# Altium project ATmega_2560_Pro.PrjPcb (part 3 of 4)
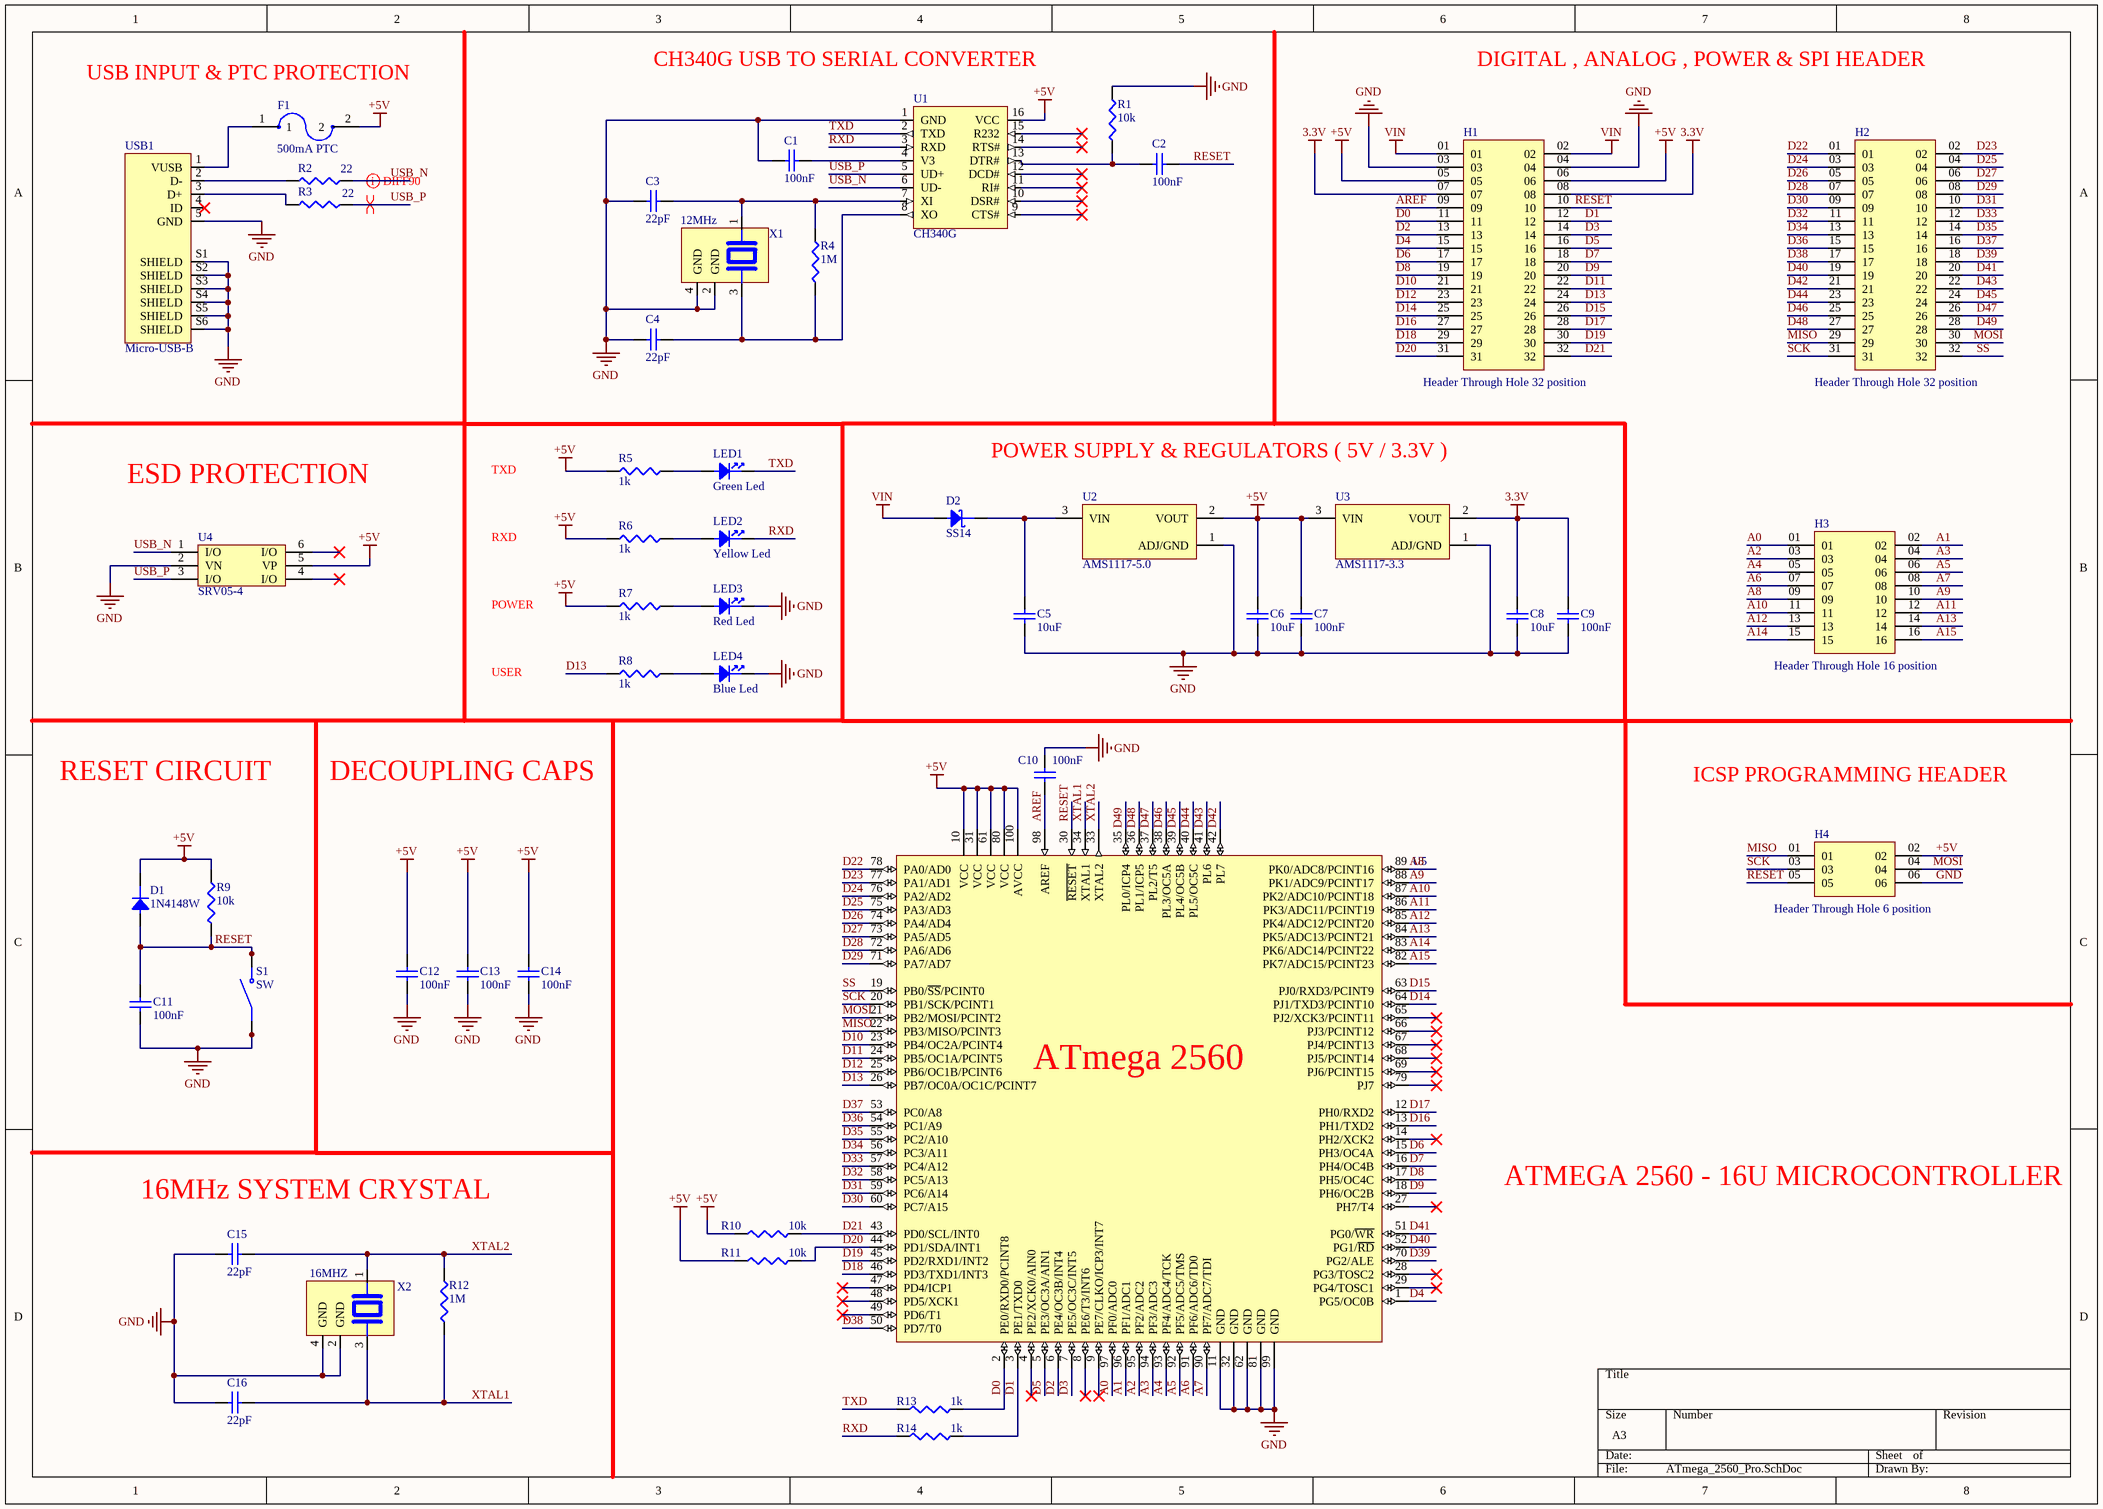
[diagram p2: ATmega_2560_Pro.SchDoc]

## Sheet ATmega_2560_Pro.SchDoc (continued)

### Library data of the parts (continued)
LED1 = 150060VS75000: LED GREEN CLEAR 0603 SMD; Manufacturer: Wurth Elektronik; Manufacturer Lifecycle Status: ACTIVE; Dominant Wavelength: 570nm; Forward Current: 100mA; Forward Voltage: 2V; Lens Style: Clear, Rectangular; Luminous Intensity: 40mcd; Max Junction Temperature (Tj): 95°C; Max Reverse Voltage (DC): 5V; Peak Wavelength: 572nm; Power Dissipation: 72mW; Test Current: 20mA; Viewing Angle: 140°; YEOL: 1 = Estimated lifetime > 10 years; Supplier: DigiKey; Supplier Part Number: 732-4980-1-ND; Manufacturer Part Number: 150060VS75000; RoHS: Compliant; Category: LEDs; Stock: 627050; Pricing: 1=0.15, 50=0.142, 100=0.1239 (USD); Case/Package: 0603; Case Code (Imperial): 0603; Case Code (Metric): 1608; Color: Green; Height: 700µm; Length: 1.6mm; Lifecycle Status: Production; Max Operating Temperature: 85°C; Min Operating Temperature: -40°C; Mounting Technology: Surface Mount; Pins: 2; Packaging: Tape and Reel; REACH SVHC: Unknown; Reverse Voltage: 5V; Wavelength: 570nm; Width: 800µm; ComponentLink1URL: https://datasheet.octopart.com:443/150060VS75000-W%C3%BCrth-Elektronik-datasheet-141404641.pdf?src-supplier=Upverter; ComponentLink1Description: https://datasheet.octopart.com:443/150060VS75000-W%C3%BCrth-Elektronik-datasheet-141404641.pdf?src-supplier=Upverter; ComponentLink2URL: https://datasheet.octopart.com:443/150060VS75000-W%C3%BCrth-Elektronik-datasheet-15983789.pdf?src-supplier=Upverter; ComponentLink2Description: https://datasheet.octopart.com:443/150060VS75000-W%C3%BCrth-Elektronik-datasheet-15983789.pdf?src-supplier=Upverter; ComponentLink3URL: https://datasheet.octopart.com:443/150060VS75000-W%C3%BCrth-Elektronik-datasheet-141916710.pdf?src-supplier=Newark; ComponentLink3Description: https://datasheet.octopart.com:443/150060VS75000-W%C3%BCrth-Elektronik-datasheet-141916710.pdf?src-supplier=Newark; ComponentLink4URL: https://datasheet.octopart.com:443/150060VS75000-W%C3%BCrth-Elektronik-datasheet-41196440.pdf?src-supplier=Newark; ComponentLink4Description: https://datasheet.octopart.com:443/150060VS75000-W%C3%BCrth-Elektronik-datasheet-41196440.pdf?src-supplier=Newark
LED2 = 150060YS75000: LED YELLOW CLEAR 0603 SMD; Manufacturer: Wurth Elektronik; Manufacturer Lifecycle Status: ACTIVE; Dominant Wavelength: 590nm; Forward Current: 100mA; Forward Voltage: 2V; Lens Style: Clear, Rectangular; Luminous Intensity: 120mcd; Max Junction Temperature (Tj): 95°C; Max Reverse Voltage (DC): 5V; Peak Wavelength: 595nm; Power Dissipation: 72mW; Test Current: 20mA; Viewing Angle: 140°; YEOL: 1 = Estimated lifetime > 10 years; Supplier: DigiKey; Supplier Part Number: 732-4981-1-ND; Manufacturer Part Number: 150060YS75000; RoHS: Compliant; Category: LEDs; Stock: 129880; Pricing: 1=0.15, 50=0.142, 100=0.1239 (USD); Case/Package: 0603; Case Code (Imperial): 0603; Case Code (Metric): 1608; Color: Yellow; Height: 700µm; Length: 1.6mm; Lifecycle Status: Production; Max Operating Temperature: 85°C; Min Operating Temperature: -40°C; Mounting Technology: Surface Mount; Packaging: Tape and Reel; REACH SVHC: Unknown; Reverse Voltage: 5V; Wavelength: 590nm; Width: 800µm; ComponentLink1URL: https://datasheet.octopart.com:443/150060YS75000-W%C3%BCrth-Elektronik-datasheet-140603452.pdf?src-supplier=Newark; ComponentLink1Description: https://datasheet.octopart.com:443/150060YS75000-W%C3%BCrth-Elektronik-datasheet-140603452.pdf?src-supplier=Newark; ComponentLink2URL: https://datasheet.octopart.com:443/150060YS75000-W%C3%BCrth-Elektronik-datasheet-41196441.pdf?src-supplier=Newark; ComponentLink2Description: https://datasheet.octopart.com:443/150060YS75000-W%C3%BCrth-Elektronik-datasheet-41196441.pdf?src-supplier=Newark; ComponentLink3URL: https://datasheet.octopart.com:443/150060YS75000-W%C3%BCrth-Elektronik-datasheet-15976795.pdf?src-supplier=Upverter; ComponentLink3Description: https://datasheet.octopart.com:443/150060YS75000-W%C3%BCrth-Elektronik-datasheet-15976795.pdf?src-supplier=Upverter
LED3 = 150060RS75000: LED RED CLEAR 0603 SMD; Manufacturer: Wurth Elektronik; Manufacturer Lifecycle Status: ACTIVE; Dominant Wavelength: 625nm; Forward Current: 100mA; Forward Voltage: 2V; Lens Style: Clear, Rectangular; Luminous Intensity: 250mcd; Max Junction Temperature (Tj): 95°C; Max Reverse Voltage (DC): 5V; Peak Wavelength: 630nm; Power Dissipation: 72mW; Test Current: 20mA; Viewing Angle: 140°; YEOL: 1 = Estimated lifetime > 10 years; Supplier: DigiKey; Supplier Part Number: 732-4978-6-ND; Manufacturer Part Number: 150060RS75000; RoHS: Compliant; Category: LEDs; Stock: 386931; Pricing: 1=0.15, 50=0.142, 100=0.1239 (USD); Case/Package: 0603; Case Code (Imperial): 0603; Case Code (Metric): 1608; Color: Red; Height: 700µm; Length: 1.6mm; Lifecycle Status: Production; Max Operating Temperature: 85°C; Min Operating Temperature: -40°C; Mounting Technology: Surface Mount; Packaging: Tape and Reel; REACH SVHC: Unknown; Reverse Voltage: 5V; Wavelength: 625nm; Width: 800µm; ComponentLink1URL: https://datasheet.octopart.com:443/150060RS75000-W%C3%BCrth-Elektronik-datasheet-141913886.pdf?src-supplier=Upverter; ComponentLink1Description: https://datasheet.octopart.com:443/150060RS75000-W%C3%BCrth-Elektronik-datasheet-141913886.pdf?src-supplier=Upverter; ComponentLink2URL: https://datasheet.octopart.com:443/150060RS75000-W%C3%BCrth-Elektronik-datasheet-15983787.pdf?src-supplier=Upverter; ComponentLink2Description: https://datasheet.octopart.com:443/150060RS75000-W%C3%BCrth-Elektronik-datasheet-15983787.pdf?src-supplier=Upverter; ComponentLink3URL: https://datasheet.octopart.com:443/150060RS75000-W%C3%BCrth-Elektronik-datasheet-140603451.pdf?src-supplier=Wurth+Elektronik; ComponentLink3Description: https://datasheet.octopart.com:443/150060RS75000-W%C3%BCrth-Elektronik-datasheet-140603451.pdf?src-supplier=Wurth+Elektronik; ComponentLink4URL: https://datasheet.octopart.com:443/150060RS75000-W%C3%BCrth-Elektronik-datasheet-41196438.pdf?src-supplier=Newark; ComponentLink4Description: https://datasheet.octopart.com:443/150060RS75000-W%C3%BCrth-Elektronik-datasheet-41196438.pdf?src-supplier=Newark
LED4 = 150060BS75000: LED BLUE CLEAR 0603 SMD; Manufacturer: Wurth Elektronik; Manufacturer Lifecycle Status: ACTIVE; Dominant Wavelength: 470nm; Forward Current: 100mA; Forward Voltage: 3.2V; Lens Style: Clear, Rectangular; Luminous Intensity: 145mcd; Max Junction Temperature (Tj): 95°C; Max Reverse Voltage (DC): 5V; Peak Wavelength: 465nm; Power Dissipation: 105mW; Test Current: 20mA; Viewing Angle: 140°; YEOL: 1 = Estimated lifetime > 10 years; Supplier: DigiKey; Supplier Part Number: 732-4966-6-ND; Manufacturer Part Number: 150060BS75000; RoHS: Compliant; Category: LEDs; Stock: 157758; Pricing: 1=0.16, 50=0.155, 100=0.1346 (USD); Case/Package: 0603; Case Code (Imperial): 0603; Case Code (Metric): 1608; Color: Blue; Height: 700µm; Length: 1.6mm; Lifecycle Status: Production; Max Operating Temperature: 85°C; Min Operating Temperature: -40°C; Mounting Technology: Surface Mount; Packaging: Tape and Reel; REACH SVHC: Unknown; Reverse Voltage: 5V; Wavelength: 470nm; Width: 800µm; ComponentLink1URL: https://datasheet.octopart.com:443/150060BS75000-W%C3%BCrth-Elektronik-datasheet-140583947.pdf?src-supplier=Newark; ComponentLink1Description: https://datasheet.octopart.com:443/150060BS75000-W%C3%BCrth-Elektronik-datasheet-140583947.pdf?src-supplier=Newark; ComponentLink2URL: https://datasheet.octopart.com:443/150060BS75000-W%C3%BCrth-Elektronik-datasheet-41196436.pdf?src-supplier=Newark; ComponentLink2Description: https://datasheet.octopart.com:443/150060BS75000-W%C3%BCrth-Elektronik-datasheet-41196436.pdf?src-supplier=Newark; ComponentLink3URL: https://datasheet.octopart.com:443/150060BS75000-W%C3%BCrth-Elektronik-datasheet-15983786.pdf?src-supplier=Upverter; ComponentLink3Description: https://datasheet.octopart.com:443/150060BS75000-W%C3%BCrth-Elektronik-datasheet-15983786.pdf?src-supplier=Upverter
R1 R9-R11 = RC0603FR-0710KL: RES 10K OHM 1% 1/10W 0603; Manufacturer 1: Yageo Group; Power Rating: 100mW; Value: 10kΩ; Temperature Coefficient: 100ppm/°C; Voltage Rating: 75V; Voltage Rating (DC): 50V; Supplier 1: DigiKey; Manufacturer Part Number 1: RC0603FR-0710KL; Stock 1: 2515430; Pricing 1: 1=0.1, 10=0.025, 25=0.0188, 50=0.015, 100=0.0122, 250=0.0094, 500=0.00782, 1000=0.00661 (USD); RoHS: Compliant; Case/Package: 0603; Case Code (Imperial): 0603; Case Code (Metric): 0603; China RoHS: Non-Compliant; Composition: Thick Film; Contact Plating: Tin; Depth: 800µm; Height: 450µm; Lead Free: Lead Free; Lead Pitch: 300µm; Length: 1.6mm; Lifecycle Status: Production; Max Operating Temperature: 155°C; Military Standard: Not; Min Operating Temperature: -55°C; Mounting Technology: Surface Mount; Pins: 2; Number of Terminals: 2; Packaging: Tape & Reel; Radiation Hardening: No; REACH SVHC: Unaffected; Schedule B: 8533210045, 8533210045|8533210045|8533210045|8533210045|8533210045|8533210045|8533210045|8533210045|8533210045|8533210045|8533210045|8533210045|8533210045|8533210045|8533210045|8533210045|8533210045|8533210045|8533210045|8533210045|8533210045|8533210045|8533210045|85; Termination: SMD/SMT; Tolerance: 1%; Weight: 2.012816mg; Width: 800µm; Working Voltage: 75V; ComponentLink1URL: https://datasheet.octopart.com:443/RC0603FR-0710KL-Yageo-datasheet-175887523.pdf?src-supplier=IHS; ComponentLink1Description: https://datasheet.octopart.com:443/RC0603FR-0710KL-Yageo-datasheet-175887523.pdf?src-supplier=IHS; ComponentLink2URL: https://datasheet.octopart.com:443/RC0603FR-0710KL-Yageo-datasheet-103092701.pdf?src-supplier=Upverter; ComponentLink2Description: https://datasheet.octopart.com:443/RC0603FR-0710KL-Yageo-datasheet-103092701.pdf?src-supplier=Upverter; ComponentLink3URL: https://datasheet.octopart.com:443/RC0603FR-0710KL-Yageo-datasheet-98239111.pdf?src-supplier=Upverter; ComponentLink3Description: https://datasheet.octopart.com:443/RC0603FR-0710KL-Yageo-datasheet-98239111.pdf?src-supplier=Upverter; ComponentLink4URL: https://datasheet.octopart.com:443/RC0603FR-0710KL-Yageo-datasheet-141265859.pdf?src-supplier=Upverter; ComponentLink4Description: https://datasheet.octopart.com:443/RC0603FR-0710KL-Yageo-datasheet-141265859.pdf?src-supplier=Upverter; ComponentLink5URL: https://sigma.octopart.com:443/138820526/technical_drawing/Yageo-RC0603FR-0710KL.pdf?src-supplier=Upverter; ComponentLink5Description: https://sigma.octopart.com:443/138820526/technical_drawing/Yageo-RC0603FR-0710KL.pdf?src-supplier=Upverter; ComponentLink6URL: https://datasheet.octopart.com:443/RC0603FR-0710KL-Yageo-datasheet-8328172.pdf?src-supplier=Farnell; ComponentLink6Description: https://datasheet.octopart.com:443/RC0603FR-0710KL-Yageo-datasheet-8328172.pdf?src-supplier=Farnell; ComponentLink7URL: https://datasheet.octopart.com:443/RC0603FR-0710KL-Yageo-datasheet-13691069.pdf?src-supplier=Farnell; ComponentLink7Description: https://datasheet.octopart.com:443/RC0603FR-0710KL-Yageo-datasheet-13691069.pdf?src-supplier=Farnell; ComponentLink8URL: https://datasheet.octopart.com:443/RC0603FR-0710KL-Yageo-datasheet-62067350.pdf?src-supplier=element14+APAC; ComponentLink8Description: https://datasheet.octopart.com:443/RC0603FR-0710KL-Yageo-datasheet-62067350.pdf?src-supplier=element14+APAC; ComponentLink9URL: https://datasheet.octopart.com:443/RC0603FR-0710KL-Yageo-datasheet-17842380.pdf?src-supplier=element14+APAC; ComponentLink9Description: https://datasheet.octopart.com:443/RC0603FR-0710KL-Yageo-datasheet-17842380.pdf?src-supplier=element14+APAC; ComponentLink10URL: https://datasheet.octopart.com:443/RC0603FR-0710KL-Yageo-datasheet-15599030.pdf?src-supplier=Future+Electronics; ComponentLink10Description: https://datasheet.octopart.com:443/RC0603FR-0710KL-Yageo-datasheet-15599030.pdf?src-supplier=Future+Electronics; ComponentLink11URL: https://datasheet.octopart.com:443/RC0603FR-0710KL-Yageo-Group-datasheet-176638170.pdf?src-supplier=Future+Electronics; ComponentLink11Description: https://datasheet.octopart.com:443/RC0603FR-0710KL-Yageo-Group-datasheet-176638170.pdf?src-supplier=Future+Electronics; ComponentLink12URL: https://datasheet.octopart.com:443/RC0603FR-0710KL-Yageo-datasheet-164759695.pdf?src-supplier=Future+Electronics; ComponentLink12Description: https://datasheet.octopart.com:443/RC0603FR-0710KL-Yageo-datasheet-164759695.pdf?src-supplier=Future+Electronics; ComponentLink13URL: https://datasheet.octopart.com:443/RC0603FR-0710KL-Yageo-datasheet-127823281.pdf?src-supplier=Future+Electronics; ComponentLink13Description: https://datasheet.octopart.com:443/RC0603FR-0710KL-Yageo-datasheet-127823281.pdf?src-supplier=Future+Electronics; ComponentLink14URL: https://datasheet.octopart.com:443/RC0603FR-0710KL-Yageo-datasheet-137700087.pdf?src-supplier=Future+Electronics; ComponentLink14Description: https://datasheet.octopart.com:443/RC0603FR-0710KL-Yageo-datasheet-137700087.pdf?src-supplier=Future+Electronics; ComponentLink15URL: https://datasheet.octopart.com:443/RC0603FR-0710KL-Yageo-datasheet-27584510.pdf?src-supplier=Future+Electronics; ComponentLink15Description: https://datasheet.octopart.com:443/RC0603FR-0710KL-Yageo-datasheet-27584510.pdf?src-supplier=Future+Electronics; ComponentLink16URL: https://datasheet.octopart.com:443/RC0603FR-0710KL-Yageo-datasheet-8324193.pdf?src-supplier=Future+Electronics; ComponentLink16Description: https://datasheet.octopart.com:443/RC0603FR-0710KL-Yageo-datasheet-8324193.pdf?src-supplier=Future+Electronics; ComponentLink17URL: https://datasheet.octopart.com:443/RC0603FR-0710KL-Yageo-datasheet-12596169.pdf?src-supplier=Newark; ComponentLink17Description: https://datasheet.octopart.com:443/RC0603FR-0710KL-Yageo-datasheet-12596169.pdf?src-supplier=Newark; ComponentLink18URL: https://datasheet.octopart.com:443/RC0603FR-0710KL-Yageo-datasheet-503470.pdf?src-supplier=Newark; ComponentLink18Description: https://datasheet.octopart.com:443/RC0603FR-0710KL-Yageo-datasheet-503470.pdf?src-supplier=Newark; ComponentLink19URL: https://datasheet.octopart.com:443/RC0603FR-0710KL-Yageo-datasheet-34211833.pdf?src-supplier=Newark; ComponentLink19Description: https://datasheet.octopart.com:443/RC0603FR-0710KL-Yageo-datasheet-34211833.pdf?src-supplier=Newark; ComponentLink20URL: https://datasheet.octopart.com:443/RC0603FR-0710KL-Yageo-Group-datasheet-189192902.pdf?src-supplier=LCSC; ComponentLink20Description: https://datasheet.octopart.com:443/RC0603FR-0710KL-Yageo-Group-datasheet-189192902.pdf?src-supplier=LCSC; ComponentLink21URL: https://datasheet.octopart.com:443/RC0603FR-0710KL-Yageo-datasheet-79472498.pdf?src-supplier=Megastar; ComponentLink21Description: https://datasheet.octopart.com:443/RC0603FR-0710KL-Yageo-datasheet-79472498.pdf?src-supplier=Megastar; ComponentLink22URL: https://datasheet.octopart.com/RC0603FR-0710KL-Yageo-datasheet-73766026.pdf; ComponentLink22Description: https://datasheet.octopart.com/RC0603FR-0710KL-Yageo-datasheet-73766026.pdf; ComponentLink23URL: https://datasheet.octopart.com:443/RC0603FR-0710KL-Yageo-datasheet-118562.pdf?src-supplier=DigiKey; ComponentLink23Description: https://datasheet.octopart.com:443/RC0603FR-0710KL-Yageo-datasheet-118562.pdf?src-supplier=DigiKey; ComponentLink24URL: http://sigma.octopart.com:80/conflict_mineral_statement/Yageo-company-3.pdf?src-supplier=Compliance+Statements; ComponentLink24Description: http://sigma.octopart.com:80/conflict_mineral_statement/Yageo-company-3.pdf?src-supplier=Compliance+Statements; ComponentLink25URL: http://sigma.octopart.com:80/rohs_statement/Yageo-company-2.pdf?src-supplier=Compliance+Statements; ComponentLink25Description: http://sigma.octopart.com:80/rohs_statement/Yageo-company-2.pdf?src-supplier=Compliance+Statements; Supplier Part Number 1: 311-10.0KHRDKR-ND
R2 R3 = RC0603FR-0722RL: RES 22 OHM 1% 1/10W 0603; Manufacturer: Yageo Group; Max Output current: 8A; Max Power Dissipation: 100mW; Min Input Voltage: 1.4V; Value: 22Ω; Temperature Coefficient: 100ppm/°C; Voltage Rating: 75V; Voltage Rating (AC): 50V; Supplier: DigiKey; Supplier Part Number: 311-22.0HRCT-ND; Manufacturer Part Number: RC0603FR-0722RL; RoHS: Compliant; Category: Chip SMD Resistors; Pricing: 1=0.1, 10=0.025, 25=0.0188, 50=0.015, 100=0.0122, 250=0.0094, 500=0.00782, 1000=0.00661 (USD); Case/Package: 0603; Case Code (Imperial): 0603; Case Code (Metric): 0603; China RoHS: Non-Compliant; Composition: Thick Film; Contact Plating: Tin; Country of Origin: Mainland China, Taiwan; Depth: 800µm; Export Control Classification Number (ECCN) Code: EAR99; Features: Moisture Resistant; Height: 450µm; Harmonized Tariff Schedule (HTS) Code: 8533.21.00.30; Introduction Date: 2004-09-22; Lead Free: Lead Free; Length: 1.6mm; Lifecycle Status: Production; Max Operating Temperature: 155°C; Military Standard: Not; Min Operating Temperature: -55°C; Mounting Technology: Surface Mount; Pins: 2; Number of Terminals: 2; Number of Terminations: 2; Output Current: 8A; Packaging: Rail/Tube; Power Rating: 100mW; Radiation Hardening: No; REACH SVHC: Unaffected; Schedule B: 8533210045, 8533210045|8533210045|8533210045|8533210045|8533210045|8533210045|8533210045|8533210045|8533210045|8533210045|8533210045|8533210045|8533210045|8533210045|8533210045|8533210045|8533210045|8533210045|8533210045|8533210045|8533210045|8533210045|8533210045|85; Termination: SMD/SMT; Tolerance: 1%; Voltage Rating (DC): 50V; Width: 800µm; Working Voltage: 75V; ComponentLink1URL: https://datasheet.octopart.com:443/RC0603FR-0722RL-Yageo-datasheet-175887523.pdf?src-supplier=IHS; ComponentLink1Description: https://datasheet.octopart.com:443/RC0603FR-0722RL-Yageo-datasheet-175887523.pdf?src-supplier=IHS; ComponentLink2URL: https://datasheet.octopart.com:443/RC0603FR-0722RL-Yageo-datasheet-62067350.pdf?src-supplier=element14+APAC; ComponentLink2Description: https://datasheet.octopart.com:443/RC0603FR-0722RL-Yageo-datasheet-62067350.pdf?src-supplier=element14+APAC; ComponentLink3URL: https://datasheet.octopart.com:443/RC0603FR-0722RL-Yageo-datasheet-8328172.pdf?src-supplier=element14+APAC; ComponentLink3Description: https://datasheet.octopart.com:443/RC0603FR-0722RL-Yageo-datasheet-8328172.pdf?src-supplier=element14+APAC; ComponentLink4URL: https://datasheet.octopart.com:443/RC0603FR-0722RL-Yageo-datasheet-103092701.pdf?src-supplier=Upverter; ComponentLink4Description: https://datasheet.octopart.com:443/RC0603FR-0722RL-Yageo-datasheet-103092701.pdf?src-supplier=Upverter; ComponentLink5URL: https://datasheet.octopart.com:443/RC0603FR-0722RL-Yageo-datasheet-98239111.pdf?src-supplier=Upverter; ComponentLink5Description: https://datasheet.octopart.com:443/RC0603FR-0722RL-Yageo-datasheet-98239111.pdf?src-supplier=Upverter; ComponentLink6URL: https://datasheet.octopart.com:443/RC0603FR-0722RL-Yageo-Group-datasheet-190305687.pdf?src-supplier=Newark; ComponentLink6Description: https://datasheet.octopart.com:443/RC0603FR-0722RL-Yageo-Group-datasheet-190305687.pdf?src-supplier=Newark; ComponentLink7URL: https://datasheet.octopart.com:443/RC0603FR-0722RL-Yageo-datasheet-12596169.pdf?src-supplier=Newark; ComponentLink7Description: https://datasheet.octopart.com:443/RC0603FR-0722RL-Yageo-datasheet-12596169.pdf?src-supplier=Newark; ComponentLink8URL: https://datasheet.octopart.com:443/RC0603FR-0722RL-Yageo-datasheet-34211833.pdf?src-supplier=Newark; ComponentLink8Description: https://datasheet.octopart.com:443/RC0603FR-0722RL-Yageo-datasheet-34211833.pdf?src-supplier=Newark; ComponentLink9URL: https://datasheet.octopart.com:443/RC0603FR-0722RL-Yageo-Group-datasheet-189192902.pdf?src-supplier=LCSC; ComponentLink9Description: https://datasheet.octopart.com:443/RC0603FR-0722RL-Yageo-Group-datasheet-189192902.pdf?src-supplier=LCSC; ComponentLink10URL: https://datasheet.octopart.com:443/RC0603FR-0722RL-Yageo-Group-datasheet-176638170.pdf?src-supplier=Future+Electronics; ComponentLink10Description: https://datasheet.octopart.com:443/RC0603FR-0722RL-Yageo-Group-datasheet-176638170.pdf?src-supplier=Future+Electronics; ComponentLink11URL: https://datasheet.octopart.com:443/RC0603FR-0722RL-Yageo-datasheet-164759695.pdf?src-supplier=Future+Electronics; ComponentLink11Description: https://datasheet.octopart.com:443/RC0603FR-0722RL-Yageo-datasheet-164759695.pdf?src-supplier=Future+Electronics; ComponentLink12URL: https://datasheet.octopart.com:443/RC0603FR-0722RL-Yageo-datasheet-127823281.pdf?src-supplier=Future+Electronics; ComponentLink12Description: https://datasheet.octopart.com:443/RC0603FR-0722RL-Yageo-datasheet-127823281.pdf?src-supplier=Future+Electronics; ComponentLink13URL: https://datasheet.octopart.com:443/RC0603FR-0722RL-Yageo-datasheet-137700087.pdf?src-supplier=Future+Electronics; ComponentLink13Description: https://datasheet.octopart.com:443/RC0603FR-0722RL-Yageo-datasheet-137700087.pdf?src-supplier=Future+Electronics; ComponentLink14URL: https://datasheet.octopart.com:443/RC0603FR-0722RL-Yageo-datasheet-68297981.pdf?src-supplier=Future+Electronics; ComponentLink14Description: https://datasheet.octopart.com:443/RC0603FR-0722RL-Yageo-datasheet-68297981.pdf?src-supplier=Future+Electronics; ComponentLink15URL: https://datasheet.octopart.com:443/RC0603FR-0722RL-Yageo-datasheet-27584510.pdf?src-supplier=Future+Electronics; ComponentLink15Description: https://datasheet.octopart.com:443/RC0603FR-0722RL-Yageo-datasheet-27584510.pdf?src-supplier=Future+Electronics; ComponentLink16URL: https://datasheet.octopart.com:443/RC0603FR-0722RL-Yageo-datasheet-15599030.pdf?src-supplier=Future+Electronics; ComponentLink16Description: https://datasheet.octopart.com:443/RC0603FR-0722RL-Yageo-datasheet-15599030.pdf?src-supplier=Future+Electronics; ComponentLink17URL: https://datasheet.octopart.com:443/RC0603FR-0722RL-Yageo-datasheet-8324193.pdf?src-supplier=Future+Electronics; ComponentLink17Description: https://datasheet.octopart.com:443/RC0603FR-0722RL-Yageo-datasheet-8324193.pdf?src-supplier=Future+Electronics; ComponentLink18URL: https://datasheet.octopart.com:443/RC0603FR-0722RL-Yageo-datasheet-148775077.pdf?src-supplier=TME; ComponentLink18Description: https://datasheet.octopart.com:443/RC0603FR-0722RL-Yageo-datasheet-148775077.pdf?src-supplier=TME; ComponentLink19URL: https://datasheet.octopart.com/RC0603FR-0722RL-Yageo-datasheet-73766026.pdf; ComponentLink19Description: https://datasheet.octopart.com/RC0603FR-0722RL-Yageo-datasheet-73766026.pdf; ComponentLink20URL: https://datasheet.octopart.com:443/RC0603FR-0722RL-Yageo-datasheet-13691069.pdf?src-supplier=Farnell; ComponentLink20Description: https://datasheet.octopart.com:443/RC0603FR-0722RL-Yageo-datasheet-13691069.pdf?src-supplier=Farnell; ComponentLink21URL: https://datasheet.octopart.com:443/RC0603FR-0722RL-Yageo-datasheet-118562.pdf?src-supplier=DigiKey; ComponentLink21Description: https://datasheet.octopart.com:443/RC0603FR-0722RL-Yageo-datasheet-118562.pdf?src-supplier=DigiKey; ComponentLink22URL: http://sigma.octopart.com:80/conflict_mineral_statement/Yageo-company-3.pdf?src-supplier=Compliance+Statements; ComponentLink22Description: http://sigma.octopart.com:80/conflict_mineral_statement/Yageo-company-3.pdf?src-supplier=Compliance+Statements; ComponentLink23URL: http://sigma.octopart.com:80/rohs_statement/Yageo-company-2.pdf?src-supplier=Compliance+Statements; ComponentLink23Description: http://sigma.octopart.com:80/rohs_statement/Yageo-company-2.pdf?src-supplier=Compliance+Statements
R4 R12 = RC0603FR-071ML: RES 1M OHM 1% 1/10W 0603; Manufacturer 1: Yageo Group; Value: 1mF; Power Rating: 100mW; Temperature Coefficient: 100ppm/°C; Voltage Rating: 25V; Working Voltage: 75V; Supplier 1: DigiKey; Manufacturer Part Number 1: RC0603FR-071ML; Stock 1: 1117479; Pricing 1: 1=0.1, 10=0.025, 25=0.0188, 50=0.015, 100=0.0122, 250=0.0094, 500=0.00782, 1000=0.00661 (USD); RoHS: Compliant; Case/Package: 0603; Case Code (Imperial): 0603; Case Code (Metric): 0603; China RoHS: Non-Compliant; Composition: Thick Film; Country of Origin: Mainland China, Taiwan; Depth: 800µm; Diameter: 10mm; Export Control Classification Number (ECCN) Code: EAR99; Height: 450µm; Harmonized Tariff Schedule (HTS) Code: 8533.21.00.30; Introduction Date: 2004-10-04; Lead Free: Lead Free; Lead Pitch: 5mm; Length: 1.6mm; Lifecycle Status: Production; Max Operating Temperature: 155°C; Military Standard: Not; Min Operating Temperature: -55°C; Mounting Technology: Surface Mount; Pins: 2; Number of Terminals: 2; Packaging: Bulk; Radiation Hardening: No; REACH SVHC: Unaffected; Schedule B: 8533210045, 8533210045|8533210045|8533210045|8533210045|8533210045|8533210045|8533210045|8533210045|8533210045|8533210045|8533210045|8533210045|8533210045|8533210045|8533210045|8533210045|8533210045|8533210045|8533210045|8533210045|8533210045|8533210045|8533210045|85; Termination: SMD/SMT; Tolerance: 1%; Voltage Rating (DC): 25V; Width: 800µm; ComponentLink1URL: https://datasheet.octopart.com:443/RC0603FR-071ML-Yageo-datasheet-175887523.pdf?src-supplier=Newark; ComponentLink1Description: https://datasheet.octopart.com:443/RC0603FR-071ML-Yageo-datasheet-175887523.pdf?src-supplier=Newark; ComponentLink2URL: https://datasheet.octopart.com:443/RC0603FR-071ML-Yageo-datasheet-34211833.pdf?src-supplier=Newark; ComponentLink2Description: https://datasheet.octopart.com:443/RC0603FR-071ML-Yageo-datasheet-34211833.pdf?src-supplier=Newark; ComponentLink3URL: https://datasheet.octopart.com:443/RC0603FR-071ML-Yageo-datasheet-8328172.pdf?src-supplier=element14+APAC; ComponentLink3Description: https://datasheet.octopart.com:443/RC0603FR-071ML-Yageo-datasheet-8328172.pdf?src-supplier=element14+APAC; ComponentLink4URL: https://datasheet.octopart.com:443/RC0603FR-071ML-Yageo-datasheet-17842380.pdf?src-supplier=element14+APAC; ComponentLink4Description: https://datasheet.octopart.com:443/RC0603FR-071ML-Yageo-datasheet-17842380.pdf?src-supplier=element14+APAC; ComponentLink5URL: https://datasheet.octopart.com:443/RC0603FR-071ML-Yageo-datasheet-62067350.pdf?src-supplier=Farnell; ComponentLink5Description: https://datasheet.octopart.com:443/RC0603FR-071ML-Yageo-datasheet-62067350.pdf?src-supplier=Farnell; ComponentLink6URL: https://datasheet.octopart.com:443/RC0603FR-071ML-Yageo-datasheet-13691069.pdf?src-supplier=Farnell; ComponentLink6Description: https://datasheet.octopart.com:443/RC0603FR-071ML-Yageo-datasheet-13691069.pdf?src-supplier=Farnell; ComponentLink7URL: https://datasheet.octopart.com:443/RC0603FR-071ML-Yageo-datasheet-103092701.pdf?src-supplier=Upverter; ComponentLink7Description: https://datasheet.octopart.com:443/RC0603FR-071ML-Yageo-datasheet-103092701.pdf?src-supplier=Upverter; ComponentLink8URL: https://datasheet.octopart.com:443/RC0603FR-071ML-Yageo-datasheet-79472498.pdf?src-supplier=Upverter; ComponentLink8Description: https://datasheet.octopart.com:443/RC0603FR-071ML-Yageo-datasheet-79472498.pdf?src-supplier=Upverter; ComponentLink9URL: https://datasheet.octopart.com:443/RC0603FR-071ML-Yageo-Group-datasheet-189192902.pdf?src-supplier=LCSC; ComponentLink9Description: https://datasheet.octopart.com:443/RC0603FR-071ML-Yageo-Group-datasheet-189192902.pdf?src-supplier=LCSC; ComponentLink10URL: https://datasheet.octopart.com:443/RC0603FR-071ML-Yageo-Group-datasheet-176638170.pdf?src-supplier=Future+Electronics; ComponentLink10Description: https://datasheet.octopart.com:443/RC0603FR-071ML-Yageo-Group-datasheet-176638170.pdf?src-supplier=Future+Electronics; ComponentLink11URL: https://datasheet.octopart.com:443/RC0603FR-071ML-Yageo-datasheet-164759695.pdf?src-supplier=Future+Electronics; ComponentLink11Description: https://datasheet.octopart.com:443/RC0603FR-071ML-Yageo-datasheet-164759695.pdf?src-supplier=Future+Electronics; ComponentLink12URL: https://datasheet.octopart.com:443/RC0603FR-071ML-Yageo-datasheet-137700087.pdf?src-supplier=Future+Electronics; ComponentLink12Description: https://datasheet.octopart.com:443/RC0603FR-071ML-Yageo-datasheet-137700087.pdf?src-supplier=Future+Electronics; ComponentLink13URL: https://datasheet.octopart.com:443/RC0603FR-071ML-Yageo-datasheet-27584510.pdf?src-supplier=Future+Electronics; ComponentLink13Description: https://datasheet.octopart.com:443/RC0603FR-071ML-Yageo-datasheet-27584510.pdf?src-supplier=Future+Electronics; ComponentLink14URL: https://datasheet.octopart.com:443/RC0603FR-071ML-Yageo-datasheet-15599030.pdf?src-supplier=Future+Electronics; ComponentLink14Description: https://datasheet.octopart.com:443/RC0603FR-071ML-Yageo-datasheet-15599030.pdf?src-supplier=Future+Electronics; ComponentLink15URL: https://datasheet.octopart.com:443/RC0603FR-071ML-Yageo-datasheet-12596169.pdf?src-supplier=Future+Electronics; ComponentLink15Description: https://datasheet.octopart.com:443/RC0603FR-071ML-Yageo-datasheet-12596169.pdf?src-supplier=Future+Electronics; ComponentLink16URL: https://datasheet.octopart.com:443/RC0603FR-071ML-Yageo-datasheet-8324193.pdf?src-supplier=Future+Electronics; ComponentLink16Description: https://datasheet.octopart.com:443/RC0603FR-071ML-Yageo-datasheet-8324193.pdf?src-supplier=Future+Electronics; ComponentLink17URL: https://datasheet.octopart.com/RC0603FR-071ML-Yageo-datasheet-73766026.pdf; ComponentLink17Description: https://datasheet.octopart.com/RC0603FR-071ML-Yageo-datasheet-73766026.pdf; ComponentLink18URL: https://datasheet.octopart.com:443/RC0603FR-071ML-Yageo-datasheet-30459151.pdf?src-supplier=Seeed+Studio; ComponentLink18Description: https://datasheet.octopart.com:443/RC0603FR-071ML-Yageo-datasheet-30459151.pdf?src-supplier=Seeed+Studio; ComponentLink19URL: https://datasheet.octopart.com:443/RC0603FR-071ML-Yageo-datasheet-118562.pdf?src-supplier=DigiKey; ComponentLink19Description: https://datasheet.octopart.com:443/RC0603FR-071ML-Yageo-datasheet-118562.pdf?src-supplier=DigiKey; ComponentLink20URL: https://datasheet.octopart.com:443/RC0603FR-071ML-Yageo-datasheet-503470.pdf?src-supplier=element14; ComponentLink20Description: https://datasheet.octopart.com:443/RC0603FR-071ML-Yageo-datasheet-503470.pdf?src-supplier=element14; ComponentLink21URL: http://sigma.octopart.com:80/conflict_mineral_statement/Yageo-company-3.pdf?src-supplier=Compliance+Statements; ComponentLink21Description: http://sigma.octopart.com:80/conflict_mineral_statement/Yageo-company-3.pdf?src-supplier=Compliance+Statements; ComponentLink22URL: http://sigma.octopart.com:80/rohs_statement/Yageo-company-2.pdf?src-supplier=Compliance+Statements; ComponentLink22Description: http://sigma.octopart.com:80/rohs_statement/Yageo-company-2.pdf?src-supplier=Compliance+Statements; Supplier Part Number 1: 311-1.00MHRDKR-ND
R5-R8 R13 R14 = RC0603FR-071KL: RES 1K OHM 1% 1/10W 0603; Manufacturer 1: Yageo Group; Power Rating: 100mW; Value: 1kΩ; Temperature Coefficient: 100ppm/°C; Voltage Rating: 50V; Working Voltage: 75V; Supplier 1: DigiKey; Manufacturer Part Number 1: RC0603FR-071KL; Stock 1: 4851130; Pricing 1: 1=0.1, 10=0.025, 25=0.0188, 50=0.015, 100=0.0122, 250=0.0094, 500=0.00782, 1000=0.00661 (USD); RoHS: Compliant; Case/Package: 0603; Case Code (Imperial): 0603; Case Code (Metric): 0603; China RoHS: Non-Compliant; Composition: Thick Film; Contact Plating: Tin; Country of Origin: Mainland China, Taiwan; Depth: 800µm; Export Control Classification Number (ECCN) Code: EAR99; Height: 450µm; Harmonized Tariff Schedule (HTS) Code: 8533.21.00.30; Introduction Date: 2004-10-04; Lead Free: Lead Free; Length: 1.6mm; Lifecycle Status: Production; Max Operating Temperature: 155°C; Military Standard: Not; Min Operating Temperature: -55°C; Mounting Technology: Surface Mount; Pins: 2; Number of Terminals: 2; Packaging: Tape and Reel; Radiation Hardening: No; REACH SVHC: Unaffected; Schedule B: 8533210045, 8533210045|8533210045|8533210045|8533210045|8533210045|8533210045|8533210045|8533210045|8533210045|8533210045|8533210045|8533210045|8533210045|8533210045|8533210045|8533210045|8533210045|8533210045|8533210045|8533210045|8533210045|8533210045|8533210045|85; Termination: SMD/SMT; Tolerance: 1%; Voltage Rating (DC): 50V; Width: 800µm; ComponentLink1URL: https://datasheet.octopart.com:443/RC0603FR-071KL-Yageo-datasheet-175887523.pdf?src-supplier=Newark; ComponentLink1Description: https://datasheet.octopart.com:443/RC0603FR-071KL-Yageo-datasheet-175887523.pdf?src-supplier=Newark; ComponentLink2URL: https://datasheet.octopart.com:443/RC0603FR-071KL-Yageo-datasheet-34211833.pdf?src-supplier=Newark; ComponentLink2Description: https://datasheet.octopart.com:443/RC0603FR-071KL-Yageo-datasheet-34211833.pdf?src-supplier=Newark; ComponentLink3URL: https://datasheet.octopart.com:443/RC0603FR-071KL-Yageo-datasheet-12596169.pdf?src-supplier=Newark; ComponentLink3Description: https://datasheet.octopart.com:443/RC0603FR-071KL-Yageo-datasheet-12596169.pdf?src-supplier=Newark; ComponentLink4URL: https://datasheet.octopart.com:443/RC0603FR-071KL-Yageo-datasheet-499455.pdf?src-supplier=Newark; ComponentLink4Description: https://datasheet.octopart.com:443/RC0603FR-071KL-Yageo-datasheet-499455.pdf?src-supplier=Newark; ComponentLink5URL: https://datasheet.octopart.com:443/RC0603FR-071KL-Yageo-datasheet-503470.pdf?src-supplier=Newark; ComponentLink5Description: https://datasheet.octopart.com:443/RC0603FR-071KL-Yageo-datasheet-503470.pdf?src-supplier=Newark; ComponentLink6URL: https://datasheet.octopart.com:443/RC0603FR-071KL-Yageo-datasheet-62067350.pdf?src-supplier=element14+APAC; ComponentLink6Description: https://datasheet.octopart.com:443/RC0603FR-071KL-Yageo-datasheet-62067350.pdf?src-supplier=element14+APAC; ComponentLink7URL: https://datasheet.octopart.com:443/RC0603FR-071KL-Yageo-datasheet-21426514.pdf?src-supplier=element14+APAC; ComponentLink7Description: https://datasheet.octopart.com:443/RC0603FR-071KL-Yageo-datasheet-21426514.pdf?src-supplier=element14+APAC; ComponentLink8URL: https://datasheet.octopart.com:443/RC0603FR-071KL-Yageo-datasheet-141265859.pdf?src-supplier=Upverter; ComponentLink8Description: https://datasheet.octopart.com:443/RC0603FR-071KL-Yageo-datasheet-141265859.pdf?src-supplier=Upverter; ComponentLink9URL: https://datasheet.octopart.com:443/RC0603FR-071KL-Yageo-datasheet-103092701.pdf?src-supplier=Upverter; ComponentLink9Description: https://datasheet.octopart.com:443/RC0603FR-071KL-Yageo-datasheet-103092701.pdf?src-supplier=Upverter; ComponentLink10URL: https://sigma.octopart.com:443/138820526/technical_drawing/Yageo-RC0603FR-071KL.pdf?src-supplier=Upverter; ComponentLink10Description: https://sigma.octopart.com:443/138820526/technical_drawing/Yageo-RC0603FR-071KL.pdf?src-supplier=Upverter; ComponentLink11URL: https://datasheet.octopart.com:443/RC0603FR-071KL-Yageo-datasheet-68297981.pdf?src-supplier=Upverter; ComponentLink11Description: https://datasheet.octopart.com:443/RC0603FR-071KL-Yageo-datasheet-68297981.pdf?src-supplier=Upverter; ComponentLink12URL: https://datasheet.octopart.com:443/RC0603FR-071KL-Yageo-datasheet-8328172.pdf?src-supplier=Farnell; ComponentLink12Description: https://datasheet.octopart.com:443/RC0603FR-071KL-Yageo-datasheet-8328172.pdf?src-supplier=Farnell; ComponentLink13URL: https://datasheet.octopart.com:443/RC0603FR-071KL-Yageo-datasheet-13691069.pdf?src-supplier=Farnell; ComponentLink13Description: https://datasheet.octopart.com:443/RC0603FR-071KL-Yageo-datasheet-13691069.pdf?src-supplier=Farnell; ComponentLink14URL: https://datasheet.octopart.com:443/RC0603FR-071KL-Yageo-datasheet-15599030.pdf?src-supplier=Seeed+Studio; ComponentLink14Description: https://datasheet.octopart.com:443/RC0603FR-071KL-Yageo-datasheet-15599030.pdf?src-supplier=Seeed+Studio; ComponentLink15URL: https://datasheet.octopart.com:443/RC0603FR-071KL-Yageo-Group-datasheet-176638170.pdf?src-supplier=Future+Electronics; ComponentLink15Description: https://datasheet.octopart.com:443/RC0603FR-071KL-Yageo-Group-datasheet-176638170.pdf?src-supplier=Future+Electronics; ComponentLink16URL: https://datasheet.octopart.com:443/RC0603FR-071KL-Yageo-datasheet-164759695.pdf?src-supplier=Future+Electronics; ComponentLink16Description: https://datasheet.octopart.com:443/RC0603FR-071KL-Yageo-datasheet-164759695.pdf?src-supplier=Future+Electronics; ComponentLink17URL: https://datasheet.octopart.com:443/RC0603FR-071KL-Yageo-datasheet-137700087.pdf?src-supplier=Future+Electronics; ComponentLink17Description: https://datasheet.octopart.com:443/RC0603FR-071KL-Yageo-datasheet-137700087.pdf?src-supplier=Future+Electronics; ComponentLink18URL: https://datasheet.octopart.com:443/RC0603FR071KL-Yageo-datasheet-27584510.pdf?src-supplier=Future+Electronics; ComponentLink18Description: https://datasheet.octopart.com:443/RC0603FR071KL-Yageo-datasheet-27584510.pdf?src-supplier=Future+Electronics; ComponentLink19URL: https://datasheet.octopart.com:443/RC0603FR-071KL-Yageo-datasheet-8324193.pdf?src-supplier=Future+Electronics; ComponentLink19Description: https://datasheet.octopart.com:443/RC0603FR-071KL-Yageo-datasheet-8324193.pdf?src-supplier=Future+Electronics; ComponentLink20URL: https://datasheet.octopart.com:443/RC0603FR-071KL-Yageo-datasheet-79472498.pdf?src-supplier=Megastar; ComponentLink20Description: https://datasheet.octopart.com:443/RC0603FR-071KL-Yageo-datasheet-79472498.pdf?src-supplier=Megastar; ComponentLink21URL: https://datasheet.octopart.com/RC0603FR-071KL-Yageo-datasheet-73766026.pdf; ComponentLink21Description: https://datasheet.octopart.com/RC0603FR-071KL-Yageo-datasheet-73766026.pdf; ComponentLink22URL: https://datasheet.octopart.com:443/RC0603FR-071KL-Yageo-datasheet-118562.pdf?src-supplier=DigiKey; ComponentLink22Description: https://datasheet.octopart.com:443/RC0603FR-071KL-Yageo-datasheet-118562.pdf?src-supplier=DigiKey; ComponentLink23URL: http://sigma.octopart.com:80/conflict_mineral_statement/Yageo-company-3.pdf?src-supplier=Compliance+Statements; ComponentLink23Description: http://sigma.octopart.com:80/conflict_mineral_statement/Yageo-company-3.pdf?src-supplier=Compliance+Statements; ComponentLink24URL: http://sigma.octopart.com:80/rohs_statement/Yageo-company-2.pdf?src-supplier=Compliance+Statements; ComponentLink24Description: http://sigma.octopart.com:80/rohs_statement/Yageo-company-2.pdf?src-supplier=Compliance+Statements; Supplier Part Number 1: 311-1.00KHRDKR-ND
S1 = TS-1187A-B-A-B: SWITCH TACTILE SPST-NO 0.05A 12V SMD 3X4MM
U1 = CH340G: USB to Serial UART Interface Controller IC, SOP-16, 5V/3.3V, 12MHz External Crystal Required
U2 = AMS1117-5.0: IC REG LINEAR 5.1V 1A SOT-223-3L; Manufacturer: Revvo; Supplier: DigiKey; Supplier Part Number: 5272-AMS1117-5.0TR-ND; Manufacturer Part Number: AMS1117-5.0; Category: LDO Voltage Regulators; Stock: 12500; Pricing: 2500=0.12353, 5000=0.11968, 7500=0.11775, 12500=0.11561, 17500=0.11436, 25000=0.11316 (USD)
U3 = AMS1117-3.3: IC REG LINEAR 3.3V 1A SOT-223-3L; Manufacturer: UMW(Youtai Semiconductor Co., Ltd.); Supplier: DigiKey; Supplier Part Number: 4518-AMS1117-3.3TR-ND; Manufacturer Part Number: AMS1117-3.3; Category: LDO Voltage Regulators; Stock: 20000; Pricing: 2500=0.1247, 5000=0.12082, 7500=0.11888, 12500=0.11673, 17500=0.11547, 25000=0.11426 (USD)
U4 = SRV05-4MR6T1G: TVS DIODE 5VWM 17.5VC 6TSOP; Manufacturer: onsemi; Manufacturer Lifecycle Status: ACTIVE; Breakdown Voltage: 6V; Clamping Voltage: 17.5V; Direction: Unidirectional; Leakage Current: 5µA; Number of Bidirectional Channels: 4; Number of Elements: 1; Peak Pulse Current: 5A; Peak Pulse Power: 300W; Power Line Protection: Yes; Reverse Standoff Voltage: 5V; Supplier: DigiKey; Supplier Part Number: 488-SRV05-4MR6T1GDKR-ND; Manufacturer Part Number: SRV05-4MR6T1G; RoHS: Compliant; Category: TVS Diodes; Stock: 11826; Pricing: 1=3.34, 10=2.171, 50=1.6658, 100=1.503, 500=1.21752 (USD); Case/Package: TSOP; China RoHS: Compliant; Depth: 1.5mm; Lead Free: Lead Free; Length: 3mm; Lifecycle Status: Production; Max Operating Temperature: 125°C; Min Breakdown Voltage: 6V; Min Operating Temperature: -55°C; Number of Channels: 4; Pins: 6; Number of Terminals: 6; Packaging: Tape and Reel; Peak Reverse Current: 5µA; Polarity: Unidirectional; Radiation Hardening: No; REACH SVHC: Unaffected; Schedule B: 8536300000, 8536300000|8536300000|8536300000|8536300000|8536300000; Working Voltage: 5V; ComponentLink1URL: https://datasheet.octopart.com:443/SRV05-4MR6T1G-ON-Semiconductor-datasheet-101150056.pdf?src-supplier=Electro+Sonic; ComponentLink1Description: https://datasheet.octopart.com:443/SRV05-4MR6T1G-ON-Semiconductor-datasheet-101150056.pdf?src-supplier=Electro+Sonic; ComponentLink2URL: https://datasheet.octopart.com:443/SRV05-4MR6T1G-onsemi-datasheet-180969720.pdf?src-supplier=IHS; ComponentLink2Description: https://datasheet.octopart.com:443/SRV05-4MR6T1G-onsemi-datasheet-180969720.pdf?src-supplier=IHS; ComponentLink3URL: https://datasheet.octopart.com:443/SRV05-4MR6T1G-ON-Semiconductor-datasheet-37178284.pdf?src-supplier=Future+Electronics; ComponentLink3Description: https://datasheet.octopart.com:443/SRV05-4MR6T1G-ON-Semiconductor-datasheet-37178284.pdf?src-supplier=Future+Electronics; ComponentLink4URL: https://datasheet.octopart.com:443/SRV05-4MR6T1G-ON-Semiconductor-datasheet-100437403.pdf?src-supplier=Farnell; ComponentLink4Description: https://datasheet.octopart.com:443/SRV05-4MR6T1G-ON-Semiconductor-datasheet-100437403.pdf?src-supplier=Farnell; ComponentLink5URL: https://datasheet.octopart.com:443/SRV05-4MR6T1G-onsemi-datasheet-164731279.pdf?src-supplier=Newchip+Electronics+Limited; ComponentLink5Description: https://datasheet.octopart.com:443/SRV05-4MR6T1G-onsemi-datasheet-164731279.pdf?src-supplier=Newchip+Electronics+Limited; ComponentLink6URL: http://sigma.octopart.com:80/150631685/rohs_statement/ON-Semiconductor-SRV05-4MR6T1G.pdf?src-supplier=Compliance+Statements; ComponentLink6Description: http://sigma.octopart.com:80/150631685/rohs_statement/ON-Semiconductor-SRV05-4MR6T1G.pdf?src-supplier=Compliance+Statements; ComponentLink7URL: http://sigma.octopart.com:80/reach_statement/ON-Semiconductor-company-79.pdf?src-supplier=Compliance+Statements; ComponentLink7Description: http://sigma.octopart.com:80/reach_statement/ON-Semiconductor-company-79.pdf?src-supplier=Compliance+Statements; ComponentLink8URL: https://octopart.com:443/opatz8j6/c1?t=GRxjOYfY8n1k7dEGnypKsoXJdizG2AyD9Dp9f5Qv8c1VKoN6Hi3oNDCVMFQ1YA2smcwUYk7_76S3Ef3Va8VDMphxCFMUbAegA5s6gVuY1yDEeomlnwz1aAKRIpnWkIz8LXicEWMcXhbWzpBI80n6_k_-slWBpLxY0NALUvjCUcDg2IL1fScQjZ7PuufKuxm_nn3UzkM4saBqj0lTwdOAMWbn7IoLSNr2avL33e6zQMcHuFNsVRsb1LLhsdyz2XVsDLyzl6dAmv0uXcf72h1DDLkKQol2Y6UBQGHK0dqwsy23JJC0slEMc9s0aJfe8dT4jPLvdDcjp3fcfNZxSGJOQqM-c0A9ey8i6J50A0KjVuwk&src-supplier=Compliance+Statements; ComponentLink8Description: https://octopart.com:443/opatz8j6/c1?t=GRxjOYfY8n1k7dEGnypKsoXJdizG2AyD9Dp9f5Qv8c1VKoN6Hi3oNDCVMFQ1YA2smcwUYk7_76S3Ef3Va8VDMphxCFMUbAegA5s6gVuY1yDEeomlnwz1aAKRIpnWkIz8LXicEWMcXhbWzpBI80n6_k_-slWBpLxY0NALUvjCUcDg2IL1fScQjZ7PuufKuxm_nn3UzkM4saBqj0lTwdOAMWbn7IoLSNr2avL33e6zQMcHuFNsVRsb1LLhsdyz2XVsDLyzl6dAmv0uXcf72h1DDLkKQol2Y6UBQGHK0dqwsy23JJC0slEMc9s0aJfe8dT4jPLvdDcjp3fcfNZxSGJOQqM-c0A9ey8i6J50A0KjVuwk&src-supplier=Compliance+Statements; ComponentLink9URL: https://octopart.com:443/opatz8j6/c1?t=lIUu1jb1ZZRo0qNmGIs9ba_OX116NqmQw_7oX-a3VPsaRdpp2HX_z2MCNOU07deCx-7PfvGmO6_0MJ30XVqsocWFNYMuX7jSZV6OPR9qZBLnVN_NcijYgOZ6fSGcJacu18z9XUouhaVhsRzrXPPLHaw78_5sQ7NBQwHcDioWErEMnZRHVeQUftrR8xKUYOxNwSSeqHi24SW0Dez_z3TsJuZaMiNnjW8b7pRvXBZcZ57ZArFUxPiKq0rrWhwKV2e6QnTz9xddmIQnZCvSJURlCU66Y9JTKD93_tff41mJUd2RJ-VHH_GdqJ18jt0FG4i79NtaZFXnkA15LDipeISURt08TJ8Mcy9aqVk_kUsfhXY&src-supplier=Compliance+Statements; ComponentLink9Description: https://octopart.com:443/opatz8j6/c1?t=lIUu1jb1ZZRo0qNmGIs9ba_OX116NqmQw_7oX-a3VPsaRdpp2HX_z2MCNOU07deCx-7PfvGmO6_0MJ30XVqsocWFNYMuX7jSZV6OPR9qZBLnVN_NcijYgOZ6fSGcJacu18z9XUouhaVhsRzrXPPLHaw78_5sQ7NBQwHcDioWErEMnZRHVeQUftrR8xKUYOxNwSSeqHi24SW0Dez_z3TsJuZaMiNnjW8b7pRvXBZcZ57ZArFUxPiKq0rrWhwKV2e6QnTz9xddmIQnZCvSJURlCU66Y9JTKD93_tff41mJUd2RJ-VHH_GdqJ18jt0FG4i79NtaZFXnkA15LDipeISURt08TJ8Mcy9aqVk_kUsfhXY&src-supplier=Compliance+Statements